# Altium schematic sheet audio_amp_hf.SchDoc
size A4
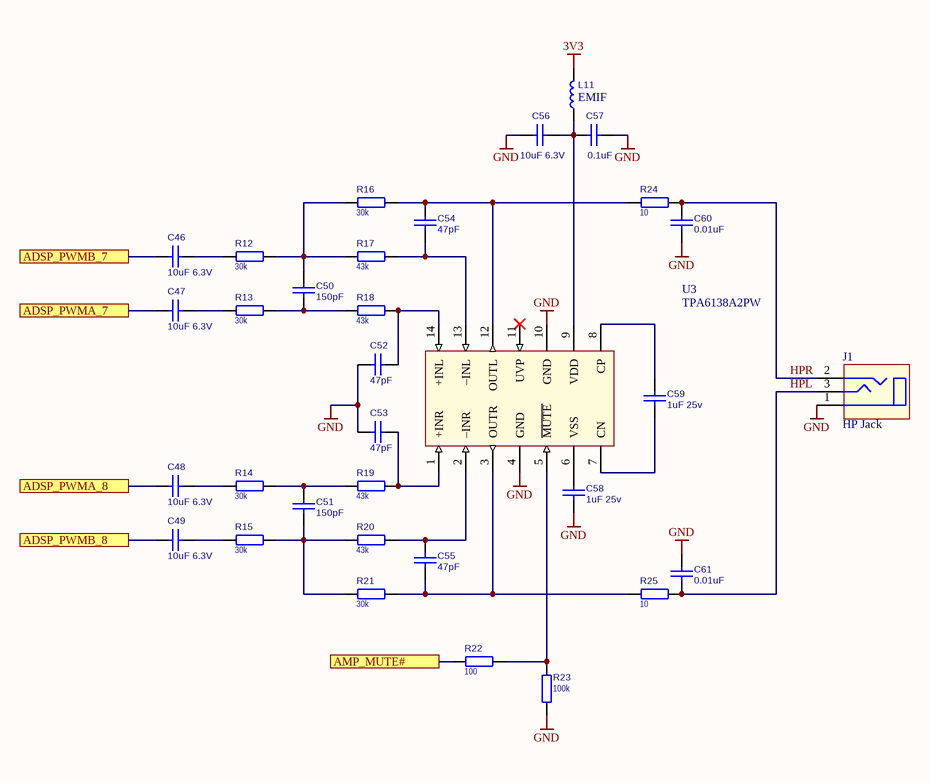
[diagram p0: audio_amp_hf.SchDoc]

## Parts
C46  value 10uF 6.3V  [C0603]  (hidden comment: CC0603MRX5R5BB106)
C47  value 10uF 6.3V  [C0603]  (hidden comment: CC0603MRX5R5BB106)
C48  value 10uF 6.3V  [C0603]  (hidden comment: CC0603MRX5R5BB106)
C49  value 10uF 6.3V  [C0603]  (hidden comment: CC0603MRX5R5BB106)
C50  value 150pF  [C0603]  (hidden comment: CC0603JRNPO9BN151)
C51  value 150pF  [C0603]  (hidden comment: CC0603JRNPO9BN151)
C52  value 47pF  [C0603]  (hidden comment: CC0603JRNPO9BN470)
C53  value 47pF  [C0603]  (hidden comment: CC0603JRNPO9BN470)
C54  value 47pF  [C0603]  (hidden comment: CC0603JRNPO9BN470)
C55  value 47pF  [C0603]  (hidden comment: CC0603JRNPO9BN470)
C56  value 10uF 6.3V  [C0603]  (hidden comment: CC0603MRX5R5BB106)
C57  value 0.1uF  [C0603]  (hidden comment: C1608X7R1H104K080AA)
C58  value 1uF 25v  [C0603]  (hidden comment: GRM188R61E105KA12D)
C59  value 1uF 25v  [C0603]  (hidden comment: GRM188R61E105KA12D)
C60  value 0.01uF  [C0603]  (hidden comment: CL10B103KB8NNNC)
C61  value 0.01uF  [C0603]  (hidden comment: CL10B103KB8NNNC)
J1  value HP Jack  [AUB-13]  (hidden comment: AUB-13)
L11  value EMIF  [IND0603]  (hidden comment: BLM18AG102SN1D)
R12  30k  [R0603]
R13  30k  [R0603]
R14  30k  [R0603]
R15  30k  [R0603]
R16  30k  [R0603]
R17  43k  [R0603]
R18  43k  [R0603]
R19  43k  [R0603]
R20  43k  [R0603]
R21  30k  [R0603]
R22  100  [R0603]
R23  100k  [R0603]
R24  10  [R0805]
R25  10  [R0805]
U3  TPA6138A2PW  [TSSOP-14]

## Ports
ADSP_PWMA_7, ADSP_PWMA_8, ADSP_PWMB_7, ADSP_PWMB_8, AMP_MUTE#

## Nets
3V3: L11.2
GND: C52.2 C53.2 C56.2 C57.1 C58.1 C60.1 C61.2 J1.1(C) R23.2 U3.4(GND) U3.10(GND)
ADSP_PWMA_7: C47.2 ; port ADSP_PWMA_7
ADSP_PWMA_8: C48.2 ; port ADSP_PWMA_8
ADSP_PWMB_7: C46.2 ; port ADSP_PWMB_7
ADSP_PWMB_8: C49.2 ; port ADSP_PWMB_8
AMP_MUTE#: R22.1 ; port AMP_MUTE#
HPL: C61.1 J1.3(L) R25.1
HPR: C60.2 J1.2(R) R24.1
NetC46_1: C46.1 R12.2
NetC47_1: C47.1 R13.2
NetC48_1: C48.1 R14.2
NetC49_1: C49.1 R15.2
NetC50_1: C50.1 R13.1 R18.2
NetC50_2: C50.2 R12.1 R16.2 R17.2
NetC51_1: C51.1 R15.1 R20.2 R21.2
NetC51_2: C51.2 R14.1 R19.2
NetC52_1: C52.1 R18.1 U3.14(+INL)
NetC53_1: C53.1 R19.1 U3.1(+INR)
NetC54_1: C54.1 R17.1 U3.13(–INL)
NetC54_2: C54.2 R16.1 R24.2 U3.12(OUTL)
NetC55_1: C55.1 R21.1 R25.2 U3.3(OUTR)
NetC55_2: C55.2 R20.1 U3.2(–INR)
NetC56_1: C56.1 C57.2 L11.1 U3.9(VDD)
NetC58_2: C58.2 U3.6(VSS)
NetC59_1: C59.1 U3.7(CN)
NetC59_2: C59.2 U3.8(CP)
NetR22_2: R22.2 R23.1 U3.5(~{MUTE})

Not connected (* = marked no-connect by the designer): U3 11(UVP)*

## Library data of the parts
C46-C61 = CAP_NPOL
J1 = PhoneJack: Phonejack Stereo
L11 = IND_WO_IRON
R12-R25 = RESISTOR: RES
  R12-R16 R21: Value: 30k
  R17-R20: Value: 43k
  R22: Value: 100
  R23: Value: 100k
  R24 R25: Value: 10
U3 = TPA6138A2: DirectPath™ Headphone Driver With Adjustable Gain; value: TPA6138A2PW